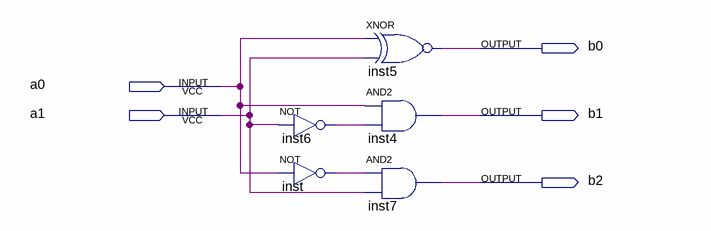
[diagram p0: schematic sheet]
// Quartus schematic base3.bdf as structural Verilog: 5 symbols, 5 pins
module base3 (
  input  a0,
  input  a1,
  output b0,
  output b1,
  output b2
);

  wire inst6_out, inst_out;

  not inst6 (inst6_out, a1);
  not inst (inst_out, a0);
  xnor inst5 (b0, a0, a1);
  and inst4 (b1, a0, inst6_out);
  and inst7 (b2, inst_out, a1);
endmodule
